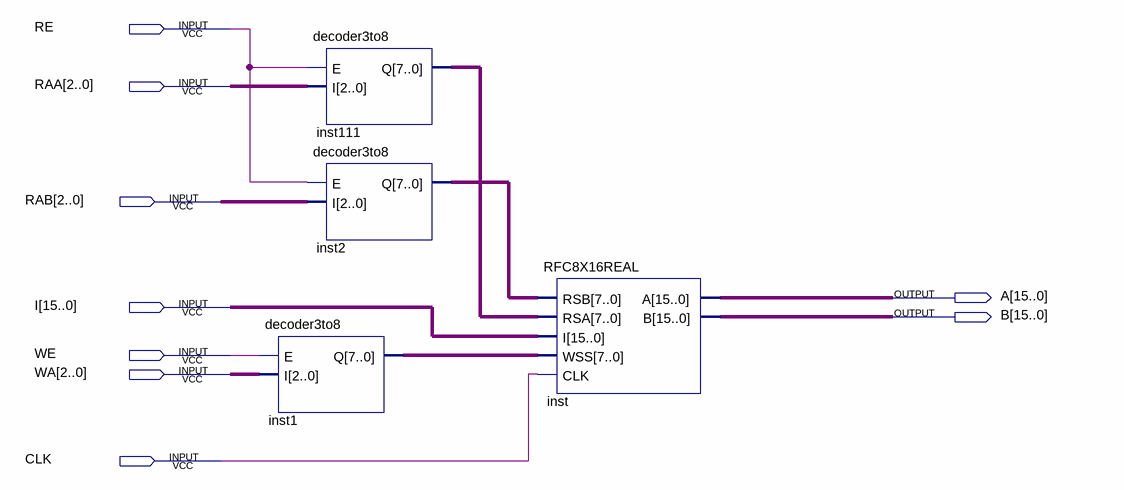
[diagram p0: schematic sheet]
// Quartus schematic REGISTERFILE.bdf as structural Verilog: 4 symbols, 9 pins
module REGISTERFILE (
  input  RE,
  input  [2:0] RAA,
  input  [2:0] RAB,
  input  [15:0] I,
  input  WE,
  input  [2:0] WA,
  input  CLK,
  output [15:0] A,
  output [15:0] B
);

  wire [7:0] inst1_q, inst2_q, inst111_q;

  decoder3to8 inst1 (.E(WE), .I(WA), .Q(inst1_q));
  decoder3to8 inst111 (.E(RE), .I(RAA), .Q(inst111_q));
  decoder3to8 inst2 (.E(RE), .I(RAB), .Q(inst2_q));
  RFC8X16REAL inst (.RSB(inst2_q), .RSA(inst111_q), .I(I), .WSS(inst1_q), .CLK(CLK), .A(A), .B(B));
endmodule
